# Altium schematic sheet QEA_Interface.SchDoc
size A4
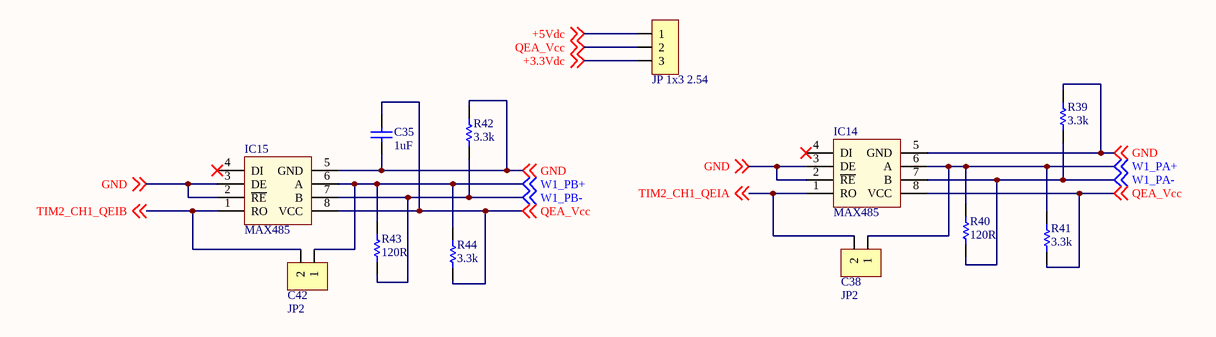
[diagram p0: QEA_Interface.SchDoc]

## Parts
C35  1uF  [tu 0603]
C38  JP2  [JP2-CLOSED]
C42  JP2  [JP2-CLOSED]
IC14  MAX485  [SO8]
IC15  MAX485  [SO8]
JP4  JP 1x3 2.54  [JP 1x3 DT]
R39  3.3k  [RES 0603]
R40  120R  [RES 0603]
R41  3.3k  [RES 0603]
R42  3.3k  [RES 0603]
R43  120R  [RES 0603]
R44  3.3k  [RES 0603]

## Nets
+3.3Vdc: JP4.3 ; off-sheet +3.3Vdc
+5Vdc: JP4.1 ; off-sheet +5Vdc
GND: C35.1 IC14.2(~{RE}) IC14.3(DE) IC14.5(GND) IC15.2(~{RE}) IC15.3(DE) IC15.5(GND) R39.2 R42.2 ; off-sheet GND
QEA_Vcc: C35.2 IC14.8(VCC) IC15.8(VCC) JP4.2 R41.1 R44.1 ; off-sheet QEA_Vcc
TIM2_CH1_QEIA: C38.2 IC14.1(RO) ; off-sheet TIM2_CH1_QEIA
TIM2_CH1_QEIB: C42.2 IC15.1(RO) ; off-sheet TIM2_CH1_QEIB
W1_PA+: C38.1 IC14.6(A) R40.2 R41.2 ; off-sheet W1_PA+
W1_PA-: IC14.7(B) R39.1 R40.1 ; off-sheet W1_PA-
W1_PB+: C42.1 IC15.6(A) R43.2 R44.2 ; off-sheet W1_PB+
W1_PB-: IC15.7(B) R42.1 R43.1 ; off-sheet W1_PB-

Not connected (* = marked no-connect by the designer): IC14 4(DI)*; IC15 4(DI)*

## Library data of the parts
C35 = Tu 0603 102 50V 10%: Dán; Don_Vi: Con; So_Chan: 2; Ten_Linh_Kien: Tụ 0603 102-1nF 10% 50V; Ma_Hang: MH004566; Chung_Loai: Dán; Kieu_Chan: *
C38 C42 = JP2: WR-PHD 2.54 mm Angled Socket Header; Manufacturer: W¨¹rth Elektronik eiSos GmbH; partNo: 613002143121; ComponentLink1 Description: Manufacturer; ComponentLink2 Description: Datasheet; NoPins: 02; Created Date: 29 March 2013; ComponentLink1URL: http://www.we-online.com; ComponentLink2URL: http://katalog.we-online.de/em/datasheet/6130xx143121.pdf; Created by: Karrer Zheng
IC14 IC15 = MAX485: RS232 - RS485 (Same sn75176)
JP4 = JP 1x3 2.54 Duc Thang: Cắm; Ten_Linh_Kien: Jump Đơn Đực 2.54MM 1x40P Thẳng 11MM; Don_Vi: Con; Ma_Hang: MH000903; Ghi_Chu: *; Kieu_Chan: *; Chung_Loai: Cắm
R39-R44 = Resistor: Semiconductor Resistor; Published: 8-Jun-2000; LatestRevisionDate: 17-Jul-2002; LatestRevisionNote: Re-released for DXP Platform.; PackageReference: AXIAL-0.5; Publisher: Altium Limited
  R39 R41 R42 R44: Value: 3.3k
  R40 R43: Value: 120R